# EAGLE design CAM_BOARD_V1_X (EAGLE 9.6.2)
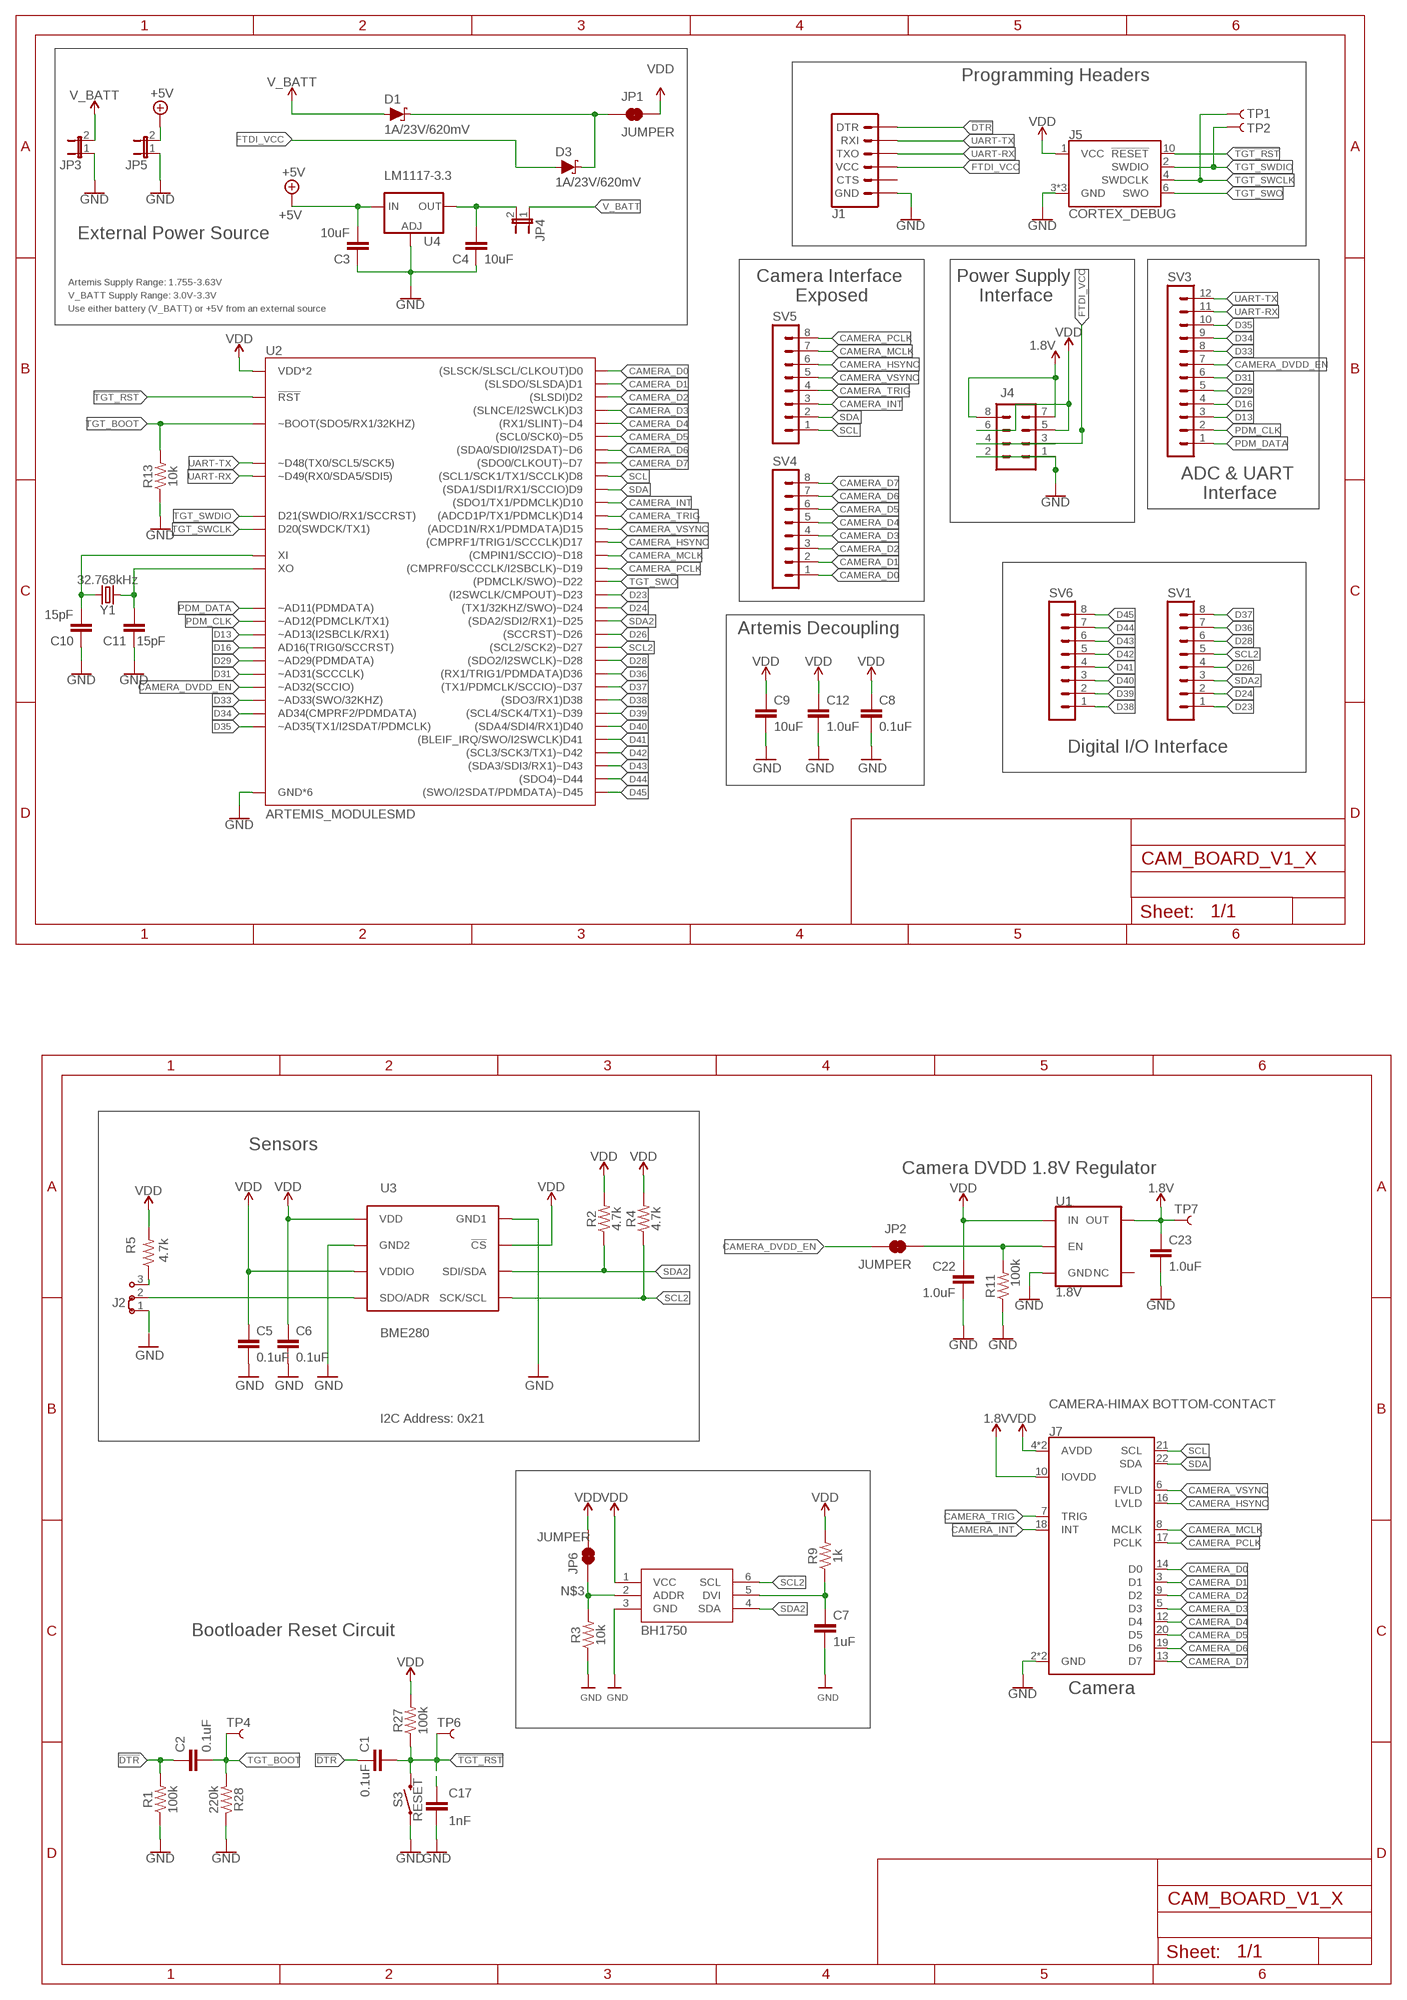
[diagram p0: schematic, sheet 1]

## Parts
C1  0.1uF  0.1UF-0603-25V-5%  [0603]
C2  0.1uF  0.1UF-0603-25V-(+80/-20%)  [0603]
C3  10uF  15PF-0603-50V-5%  [0603]
C4  10uF  15PF-0603-50V-5%  [0603]
C5  0.1uF  0.1UF-25V-5%(0603)  [0603-CAP]
C6  0.1uF  0.1UF-25V-5%(0603)  [0603-CAP]
C7  1uF  0.1UF-25V-5%(0603)  [0603-CAP]
C8  0.1uF  0.1UF-0402T-16V-10%  [0402-TIGHT]
C9  10uF  10UF-0603-6.3V-20%  [0603]
C10  15pF  15PF-0603-50V-5%  [0603]
C11  15pF  15PF-0603-50V-5%  [0603]
C12  1.0uF  1.0UF-0402T-16V-10%  [0402-TIGHT]
C17  1nF  1.0NF/1000PF-0603-50V-10%  [0603]
C22  1.0uF  1.0UF-0402-TIGHT-16V-10%  [0402-TIGHT]
C23  1.0uF  1.0UF-0402-TIGHT-16V-10%  [0402-TIGHT]
D1  1A/23V/620mV  DIODE-SCHOTTKY-BAT20J  [SOD-323]
D3  1A/23V/620mV  DIODE-SCHOTTKY-BAT20J  [SOD-323]
IC1  BH1750  [WSOF-6]
J1  6_PIN_SERIAL_TARGETSMD  [1X06-SMD_RA_MALE]
J2  J2X2MM  [04C]
J4  MA04-2  [MA04-2]
J5  CORTEX_DEBUG  CORTEX_DEBUG_MINIMUM_PTH  [2X5-PTH-1.27MM]
J7  CAMERA-HIMAX BOTTOM-CONTACT  CAMERA-HIMAXBOTTOM-CONTACT  [FPC-24-AMPHENOL-SFV24R-1STE1HLF]
JP1  JUMPER  JUMPER-COMBO_2_NC_TRACE  [COMBO-JUMPER_2_NC_TRACE]
JP2  JUMPER  JUMPER-COMBO_2_NC_TRACE  [COMBO-JUMPER_2_NC_TRACE]
JP3  JP1E  [JP1]
JP4  JP1E  [JP1]
JP5  JP1E  [JP1]
JP6  JUMPER  JUMPER-COMBO_2_NC_TRACE  [COMBO-JUMPER_2_NC_TRACE]
R1  100k  100KOHM-0603-1/10W-1%  [0603]
R2  4.7k  1KOHM-0603-1/10W-1%  [0603@1]
R3  10k  1KOHM-0603-1/10W-1%  [0603@1]
R4  4.7k  1KOHM-0603-1/10W-1%  [0603@1]
R5  4.7k  1KOHM-0603-1/10W-1%  [0603@1]
R9  1k  1KOHM-0603-1/10W-1%  [0603@1]
R11  100k  100KOHM-0402T-1/16W-1%  [0402-TIGHT]
R13  10k  10KOHM-0603-1/10W-1%  [0603@1]
R27  100k  100KOHM-0603-1/10W-1%  [0603]
R28  220k  220KOHM-0603-1/10W-1%  [0603]
S3  RESET  MOMENTARY-SWITCH-SPST-SMD-4.6X2.8MM  [TACTILE_SWITCH_SMD_4.6X2.8MM]
SV1  MA08-1  [MA08-1]
SV3  MA12-1  [MA12-1]
SV4  MA08-1  [MA08-1]
SV5  MA08-1  [MA08-1]
SV6  MA08-1  [MA08-1]
TP1  TEST-POINT3X5  [PAD.03X.05]
TP2  TEST-POINT3X5  [PAD.03X.05]
TP4  TEST-POINT3X5  [PAD.03X.05]
TP6  TEST-POINT3X5  [PAD.03X.05]
TP7  TEST-POINT3X5  [PAD.03X.05]
U1  1.8V  V_REG_AP2127K-1.8V  [SOT23-5]
U2  ARTEMIS_MODULESMD  [ARTEMIS_FP]
U3  BME280  [BME280_LGA]
U4  LM1117-3.3  V_REG_LM1117SOT223  [SOT223]
Y1  32.768kHz  CRYSTAL-32.768KHZSMD-3.2X1.5  [CRYSTAL-SMD-3.2X1.5MM]

## Nets
1.8V: C23.1 J4.7 J4.8 J7.10(IOVDD) TP7.P$1 U1.5(OUT)
!DTR: C1.1 C2.1 J1.1(DTR) R1.2
!TGT_RST: C1.2 C17.1 J5.10(!RESET) R27.1 S3.3 S3.4 TP6.P$1 U2.~RST(!RST)
+5V: C3.2 JP5.2 U4.3(IN)
CAMERA_D0: J7.14(D0) SV4.1 U2.D0((SLSCK/SLSCL/CLKOUT)D0)
CAMERA_D1: J7.3(D1) SV4.2 U2.D1((SLSDO/SLSDA)D1)
CAMERA_D2: J7.9(D2) SV4.3 U2.D2((SLSDI)D2)
CAMERA_D3: J7.5(D3) SV4.4 U2.D3((SLNCE/I2SWCLK)D3)
CAMERA_D4: J7.12(D4) SV4.5 U2.~D4((RX1/SLINT)~D4)
CAMERA_D5: J7.20(D5) SV4.6 U2.~D5((SCL0/SCK0)~D5)
CAMERA_D6: J7.19(D6) SV4.7 U2.~D6((SDA0/SDI0/I2SDAT)~D6)
CAMERA_D7: J7.13(D7) SV4.8 U2.D7((SDO0/CLKOUT)~D7)
CAMERA_DVDD_EN: JP2.1 JP2.3 SV3.7 U2.~AD32(~AD32(SCCIO))
CAMERA_HSYNC: J7.16(LVLD) SV5.6 U2.D17((CMPRF1/TRIG1/SCCCLK)D17)
CAMERA_INT: J7.18(INT) SV5.3 U2.D10((SDO1/TX1/PDMCLK)D10)
CAMERA_MCLK: J7.8(MCLK) SV5.7 U2.~D18((CMPIN1/SCCIO)~D18)
CAMERA_PCLK: J7.17(PCLK) SV5.8 U2.~D19((CMPRF0/SCCCLK/I2SBCLK)~D19)
CAMERA_TRIG: J7.7(TRIG) SV5.4 U2.D14((ADCD1P/TX1/PDMCLK)D14)
CAMERA_VSYNC: J7.6(FVLD) SV5.5 U2.D15((ADCD1N/RX1/PDMDATA)D15)
D13: SV3.3 U2.~AD13(~AD13(I2SBCLK/RX1))
D16: SV3.4 U2.AD16(AD16(TRIG0/SCCRST))
D23: SV1.1 U2.~D23((I2SWCLK/CMPOUT)~D23)
D24: SV1.2 U2.~D24((TX1/32KHZ/SWO)~D24)
D26: SV1.4 U2.~D26((SCCRST)~D26)
D28: SV1.6 U2.~D28((SDO2/I2SWCLK)~D28)
D29: SV3.5 U2.~AD29(~AD29(PDMDATA))
D31: SV3.6 U2.~AD31(~AD31(SCCCLK))
D33: SV3.8 U2.~AD33/SWO(~AD33(SWO/32KHZ))
D34: SV3.9 U2.AD34(AD34(CMPRF2/PDMDATA))
D35: SV3.10 U2.~AD35(~AD35(TX1/I2SDAT/PDMCLK))
D36: SV1.7 U2.D36((RX1/TRIG1/PDMDATA)D36)
D37: SV1.8 U2.~D37((TX1/PDMCLK/SCCIO)~D37)
D38: SV6.1 U2.D38((SDO3/RX1)D38)
D39: SV6.2 U2.~D39((SCL4/SCK4/TX1)~D39)
D40: SV6.3 U2.D40((SDA4/SDI4/RX1)D40)
D41: SV6.4 U2.D41((BLEIF_IRQ/SWO/I2SWCLK)D41)
D42: SV6.5 U2.~D42((SCL3/SCK3/TX1)~D42)
D43: SV6.6 U2.~D43((SDA3/SDI3/RX1)~D43)
D44: SV6.7 U2.~D44((SDO4)~D44)
D45: SV6.8 U2.~D45((SWO/I2SDAT/PDMDATA)~D45)
FTDI_VCC: D3.A J1.4(VCC) J4.3 J4.4
GND: C3.1 C4.1 C5.2 C6.2 C7.2 C8.1 C9.2 C10.1 C11.1 C12.2 C17.2 C22.2 C23.2 IC1.3(GND) J1.6(GND) J4.1 J4.2 J5.3(GND) J5.5(GND) J5.9(GND) J7.2(GND) J7.15(GND) JP3.1 JP5.1 R1.1 R3.1 R11.1 R13.1 R28.1 S3.1 S3.2 U1.2(GND) U2.GND@1(GND*6) U2.GND@22(GND*6) U2.GND@38(GND*6) U2.GND@39(GND*6) U2.GND@47(GND*6) U2.GND@59(GND*6) U3.P$1(GND1) U3.P$7(GND2) U4.1(ADJ)
N$1: JP2.2 JP2.4 R11.2 U1.3(EN)
N$2: C7.1 IC1.5(DVI) R9.1
N$3: IC1.2(ADDR) JP6.1 JP6.3 R3.2
N$4: C4.2 JP4.2 U4.2(OUT) U4.4(OUT)
N$5: J2.3 R5.1
N$7: J2.2 U3.P$5(SDO/ADR)
N$14: C10.2 U2.XI Y1.P$2
N$15: C11.2 U2.XO Y1.P$1
PDM_CLK: SV3.2 U2.~AD12(~AD12(PDMCLK/TX1))
PDM_DATA: SV3.1 U2.~AD11(~AD11(PDMDATA))
SCL: J7.21(SCL) SV5.1 U2.D8((SCL1/SCK1/TX1/SCCLK)D8)
SCL1: J2.1
SCL2: IC1.6(SCL) R4.1 SV1.5 U2.~D27((SCL2/SCK2)~D27) U3.P$4(SCK/SCL)
SDA: J7.22(SDA) SV5.2 U2.D9((SDA1/SDI1/RX1/SCCIO)D9)
SDA2: IC1.4(SDA) R2.1 SV1.3 U2.~D25((SDA2/SDI2/RX1)~D25) U3.P$3(SDI/SDA)
TGT_BOOT: C2.2 R13.2 R28.2 TP4.P$1 U2.BOOT(~BOOT(SDO5/RX1/32KHZ))
TGT_SWCLK: J5.4(SWDCLK) TP1.P$1 U2.SWDCK(D20(SWDCK/TX1))
TGT_SWDIO: J5.2(SWDIO) TP2.P$1 U2.SWDIO(D21(SWDIO/RX1/SCCRST))
TGT_SWO: J5.6(SWO) U2.~D22((PDMCLK/SWO)~D22)
UART-RX: J1.3(TXO) SV3.11 U2.RXI-0(~D49(RX0/SDA5/SDI5))
UART-TX: J1.2(RXI) SV3.12 U2.TXO-0(~D48(TX0/SCL5/SCK5))
V_BATT: D1.A JP3.2 JP4.1
VDD: C5.1 C6.1 C8.2 C9.1 C12.1 C22.1 IC1.1(VCC) J4.5 J4.6 J5.1(VCC) J7.4(AVDD) J7.11(AVDD) JP1.2 JP1.4 JP6.2 JP6.4 R2.2 R4.2 R5.2 R9.2 R27.2 U1.1(IN) U2.VDD@36(VDD*2) U2.VDD@37(VDD*2) U3.P$2(!CS) U3.P$6(VDDIO) U3.P$8(VDD)
VIN1: D1.C D3.C JP1.1 JP1.3
Unconnected: J1.5(CTS) J7.MNT1@0(MNT1) J7.MNT1@1(MNT1) J7.MNT2@0(MNT2) J7.MNT2@1(MNT2) U1.4(NC)

## Notes on the sheet
- Programming Headers
- External Power Source
- Artemis Supply Range: 1.755-3.63V
- Camera Interface 
  Exposed
- Power Supply 
  Interface
- V_BATT Supply Range: 3.0V-3.3V
- Use either battery (V_BATT) or +5V from an external source
- ADC & UART 
  Interface
- Artemis Decoupling
- Digital I/O Interface
- Sensors
- Camera DVDD 1.8V Regulator
- I2C Address: 0x21
- Bootloader Reset Circuit
- Camera

## Library data of the parts
C1 = SparkFun-Capacitors:0.1UF: 0.1µF ceramic capacitors A capacitor is a passive two-terminal electrical component used to store electrical energy temporarily in an electric field.; PROD_ID: CAP-08604
C2 = SparkFun-Capacitors:0.1UF: 0.1µF ceramic capacitors A capacitor is a passive two-terminal electrical component used to store electrical energy temporarily in an electric field.; PROD_ID: CAP-00810
C3 C4 = SparkFun-Capacitors:15PF: 15pF ceramic capacitors A capacitor is a passive two-terminal electrical component used to store electrical energy temporarily in an electric field.; PROD_ID: CAP-07881; VALUE: 15pF
C5 C6 = SparkFun-Capacitors:0.1UF-25V-5%(0603): CAP-08604; PROD_ID: CAP-08604
C7 = SparkFun-Capacitors:0.1UF-25V-5%(0603): CAP-08604; PROD_ID: CAP-08604; VALUE: 0.1uF
C8 = SparkFun-Capacitors:0.1UF: 0.1µF ceramic capacitors A capacitor is a passive two-terminal electrical component used to store electrical energy temporarily in an electric field.; PROD_ID: CAP-12416
C9 = SparkFun-Capacitors:10UF: 10.0µF ceramic capacitors A capacitor is a passive two-terminal electrical component used to store electrical energy temporarily in an electric field.; PROD_ID: CAP-11015
C10 C11 = SparkFun-Capacitors:15PF: 15pF ceramic capacitors A capacitor is a passive two-terminal electrical component used to store electrical energy temporarily in an electric field.; PROD_ID: CAP-07881
C12 = SparkFun-Capacitors:1.0UF: 1µF ceramic capacitors A capacitor is a passive two-terminal electrical component used to store electrical energy temporarily in an electric field.; PROD_ID: CAP-12417
C17 = SparkFun-Capacitors:1.0NF/1000PF: 1nF/1,000pF ceramic capacitors A capacitor is a passive two-terminal electrical component used to store electrical energy temporarily in an electric field.; PROD_ID: CAP-07886
C22 C23 = ambiq:1.0UF: 1µF ceramic capacitors A capacitor is a passive two-terminal electrical component used to store electrical energy temporarily in an electric field.; PROD_ID: CAP-12417
D1 D3 = SparkFun-DiscreteSemi:DIODE-SCHOTTKY: Schottky diode A Schottky diode is a semiconductor diode which has a low forward voltage drop and a very fast switching action.; PROD_ID: DIO-11623
IC1 = microbuilder:BH1750
J1 = SparkFun-Connectors:6_PIN_SERIAL_TARGET: 6-pin header connection for use with the "FTDI BASIC" pinout - TARGET SIDE. Also known as "Arduino Serial Program Header". It is used to mate with our FTDI Basic serial programmers using the Arduino IDE. Note, this device has "TARGET" in the name. It is intended to be used on a design that contains a target micro-controller that you wish to program. The "sister" device, named "CABLE" is inteneded to be used on a design that usually lives on the end of your USB cable and prvides the converter chip (FTDI232 or FTDI231x) to commnicate serial RX/TX. You can populate with some of these: Break Away Headers - Straight <https://www.sparkfun.com/products/116> (PRT-00116) For reference (or to suit your programming needs) check out these designs: SparkFun FTDI Basic Breakout - 5V <https://www.sparkfun.com/products/9716> (DEV-09716) SparkFun FTDI Basic Breakout - 3.3V <https://www.sparkfun.com/products/9873> (DEV-09873) SparkFun FTDI SmartBasic <https://www.sparkfun.com/products/12935> (DEV-12935) SparkFun Beefy 3 - FTDI Basic Breakout <https://www.sparkfun.com/products/13746> (DEV-13746); PROD_ID: CONN-08971
J2 = jumper:J2: Jumper switch 2 x 2.5 mm
J4 = con-lstb:MA04-2: PIN HEADER; OC_FARNELL: unknown; OC_NEWARK: unknown
J5 = SparkFun-Connectors:CORTEX_DEBUG_MINIMUM: Cortex Debug Connector - 10 pin Supports JTAG debug, Serial Wire debug, and Serial Wire Viewer. PTH and SMD connector options available. General Connector Information <http://infocenter.arm.com/help/topic/com.arm.doc.faqs/attached/13634/cortex_debug_connectors.pdf> Products: PTH Connector <http://www.digikey.com/product-detail/en/cnc-tech/3220-10-0100-00/1175-1627-ND/3883661> -via Digi-Key SparkFun PSoc <https://www.sparkfun.com/products/13229> SparkFun T <https://www.sparkfun.com/products/13810>
J7 = SparkFun-Connectors:CAMERA-HIMAX; DIGIKEY: 609-4320-2-ND; PROD_ID: CONN-14233
JP1 JP2 JP6 = SparkFun-Jumpers:JUMPER-COMBO_2_NC_TRACE
JP3-JP5 = jumper:JP1E: JUMPER
R1 R27 = SparkFun-Resistors:100KOHM: 100kΩ resistor A resistor is a passive two-terminal electrical component that implements electrical resistance as a circuit element. Resistors act to reduce current flow, and, at the same time, act to lower voltage levels within circuits. - Wikipedia; PROD_ID: RES-07828
R2-R5 = SparkFun-Resistors:1KOHM: 1kΩ resistor A resistor is a passive two-terminal electrical component that implements electrical resistance as a circuit element. Resistors act to reduce current flow, and, at the same time, act to lower voltage levels within circuits. - Wikipedia; PROD_ID: RES-07856; VALUE: 1k
R9 = SparkFun-Resistors:1KOHM: 1kΩ resistor A resistor is a passive two-terminal electrical component that implements electrical resistance as a circuit element. Resistors act to reduce current flow, and, at the same time, act to lower voltage levels within circuits. - Wikipedia; PROD_ID: RES-07856
R11 = SparkFun-Resistors:100KOHM: 100kΩ resistor A resistor is a passive two-terminal electrical component that implements electrical resistance as a circuit element. Resistors act to reduce current flow, and, at the same time, act to lower voltage levels within circuits. - Wikipedia; PROD_ID: RES-13495
R13 = SparkFun-Resistors:10KOHM: 10kΩ resistor A resistor is a passive two-terminal electrical component that implements electrical resistance as a circuit element. Resistors act to reduce current flow, and, at the same time, act to lower voltage levels within circuits. - Wikipedia; PROD_ID: RES-00824
R28 = SparkFun-Resistors:220KOHM: 220kΩ resistor A resistor is a passive two-terminal electrical component that implements electrical resistance as a circuit element. Resistors act to reduce current flow, and, at the same time, act to lower voltage levels within circuits. - Wikipedia; PROD_ID: RES-08969
S3 = SparkFun-Switches:MOMENTARY-SWITCH-SPST: Momentary Switch (Pushbutton) - SPST Normally-open (NO) SPST momentary switches (buttons, pushbuttons). Variants PTH-12MM - 12mm square, through-hole Momentary Pushbutton Switch - 12mm Square <https://www.sparkfun.com/products/9190> (COM-09190) PTH-6.0MM, PTH-6.0MM-KIT - 6.0mm square, through-hole Mini Pushbutton Switch <https://www.sparkfun.com/products/97> (COM-00097) KIT package intended for soldering kit's - only one side of pads' copper is exposed. PTH-RIGHT-ANGLE-KIT - Right-angle, through-hole Right Angle Tactile Button <https://www.sparkfun.com/products/10791> - Used on SparkFun BigTime Watch Kit <https://www.sparkfun.com/products/11734> SMD-12MM - 12mm square, surface-mount Tactile Button - SMD (12mm) <https://www.sparkfun.com/products/12993> (COM-12993) Used on SparkFun PicoBoard <https://www.sparkfun.com/products/11888> SMD-4.5MM - 4.5mm Square Trackball Switch Used on SparkFun Blackberry Trackballer Breakout <https://www.sparkfun.com/products/13169> SMD-4.6MMX2.8MM - 4.60mm x 2.80mm, surface mount Used on SparkFun SAMD21 Mini Breakout <https://www.sparkfun.com/products/13664> SMD-5.2MM, SMD-5.2-REDUNDANT - 5.2mm square, surface-mount Mini Pushbutton Switch - SMD <https://www.sparkfun.com/products/8720> (COM-08720) Used on Arduino Pro Mini <https://www.sparkfun.com/products/11114> REDUNDANT package connects both switch circuits together SMD-6.0X3.5MM - 6.0 x 3.5mm, surface mount Momentary Reset Switch SMD <https://www.sparkfun.com/products/8229> (COM-08229) SMD-6.2MM-TALL - 6.2mm square, surface mount Tactile Button - SMD (6mm) <https://www.sparkfun.com/products/12992> Used on SparkFun Digital Sandbox <https://www.sparkfun.com/products/12651> SMD-RIGHT-ANGLE - Right-angle, surface mount Used on SparkFun Block for Intel® Edison - Arduino <https://www.sparkfun.com/products/13036>; PROD_ID: SWCH-13065
SV1 SV4-SV6 = con-lstb:MA08-1: PIN HEADER; OC_FARNELL: unknown; OC_NEWARK: unknown
SV3 = con-lstb:MA12-1: PIN HEADER; OC_FARNELL: unknown; OC_NEWARK: unknown
TP1 TP2 TP4 TP6 TP7 = SparkFun-Connectors:TEST-POINT: SparkFun Test Points Bare copper test points for troubleshooting or In-Circuit-Testing. These are used by our Production team for verifying production board runs using pogo-pins on test beds. SparkFun Products: SparkFun LSM9DS1 Breakout <https://www.sparkfun.com/products/13284> SparkFun PSOC <https://www.sparkfun.com/products/13714> SparkFun Load Cell Amplifier <https://www.sparkfun.com/products/13879>
U1 = SparkFun-IC-Power:V_REG_AP2127: AP2127 - 300mA CMOS LDO Regulator w/ Enable The AP2127 is CMOS process low dropout linear regulator with enable function, the regulator delivers a guaranteed 300mA (min.) continuous load current. Features Output Voltage Accuracy: ±1.5% Output Current: 300mA (Min.) Foldback Short Current Protection: 50mA Enable Function to Turn ON/OFF VOUT Low Dropout Voltage (3.3V): 250mV (Typ.) @IOUT=600mA Excellent Load Regulation: 0.2%/A (Typ.) Excellent Line Regulation: 0.02%/V (Typ.) Low Quiescent Current: 55μA (Typ.) Low Standby Current: 0.01μA (Typ.) Low Output Noise: 50μVRMS PSRR: 100Hz -65dB, 1kHz -65dB OTSD Protection Stable with 1.0μF Flexible Cap: Ceramic, Tantalum and Aluminum Electrolytic Operation Temperature Range: -40°C to 85°C ESD: MM 400V, HBM 4000V; PROD_ID: VREG-14239
U2 = SparkFun-IC-Microcontroller:ARTEMIS_MODULE: Description: The Artemis Module from SparkFun is a Cortex-M4F with BLE 5.0 running up to 96MHz and with as low power as 6uA per MHz (less than 5mW). This is the world's first module to bridge the market between hobbyists and consumer products. We've packaged all the power of a modern microcontroller into a module that is both extremely easy to use but is mass-market ready. The flexibility of the Artemis module starts with our [Arduino core](https://github.com/sparkfun/Arduino_Apollo3). You can program and use the Artemis module just like you would an Uno or any other Arduino. Time to first blink is just 5 minutes away! We built the core from the ground up, making it fast and as light weight as possible.; PROD_ID: SUB-14479
U3 = BME280ComponentLibrary:BME280; PROD_ID: IC-13090
U4 = SparkFun-IC-Power:V_REG_LM1117: Voltage Regulator LM1117 Standard adjustable voltage regulator but in SMD form. Spark Fun Electronics SKU : COM-00595; PROD_ID: VREG-08170
Y1 = SparkFun-Clocks:CRYSTAL-32.768KHZ: 32.768kHz Crystal Frequency: 32.768kHz Frequency Stability: ±20ppm Load Capacitance: 12.5pF (PTH-2X6 & SMD-3.2X1.5), 6pF (SMD-2X6) SparkFun Products: SparkFun BigTime Watch Kit <https://www.sparkfun.com/products/11734> SparkFun nRF52832 Breakout <https://www.sparkfun.com/products/13990> SparkFun Real Time Clock Module <https://www.sparkfun.com/products/12708>; PROD_ID: XTAL-13062

## Board
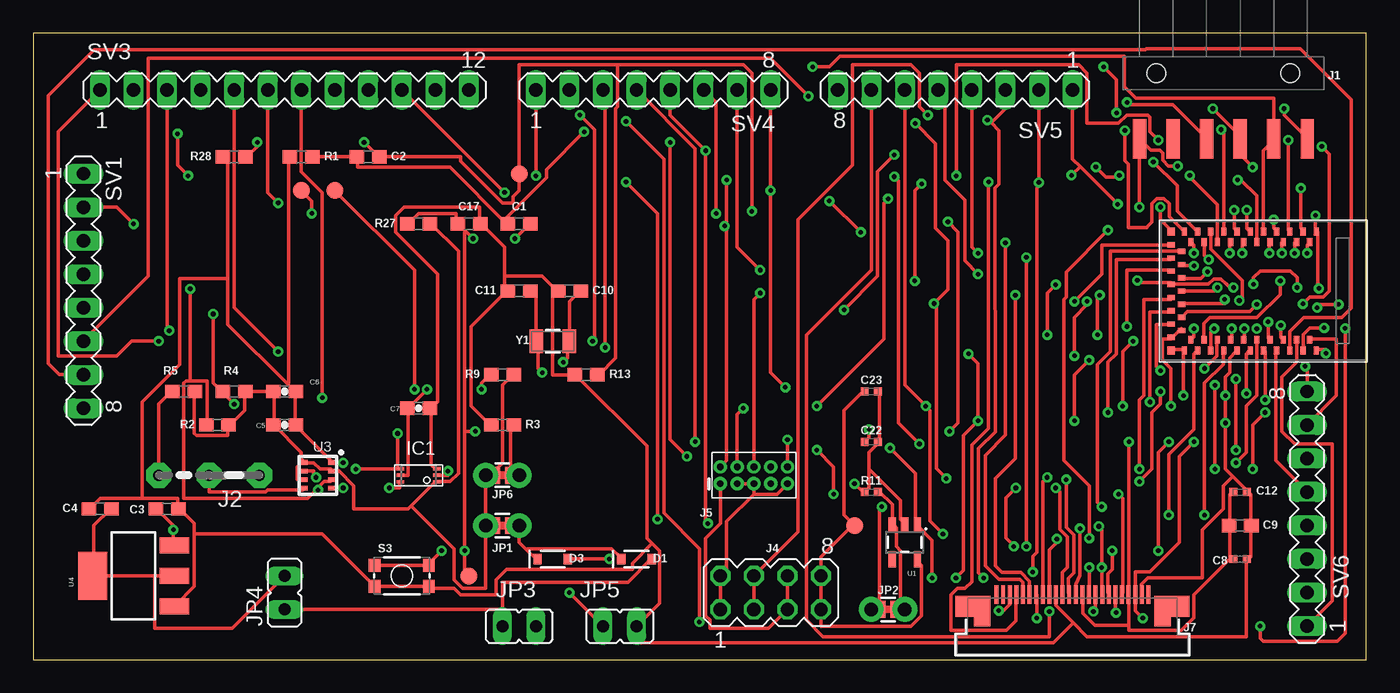
[diagram p1: board, top side]
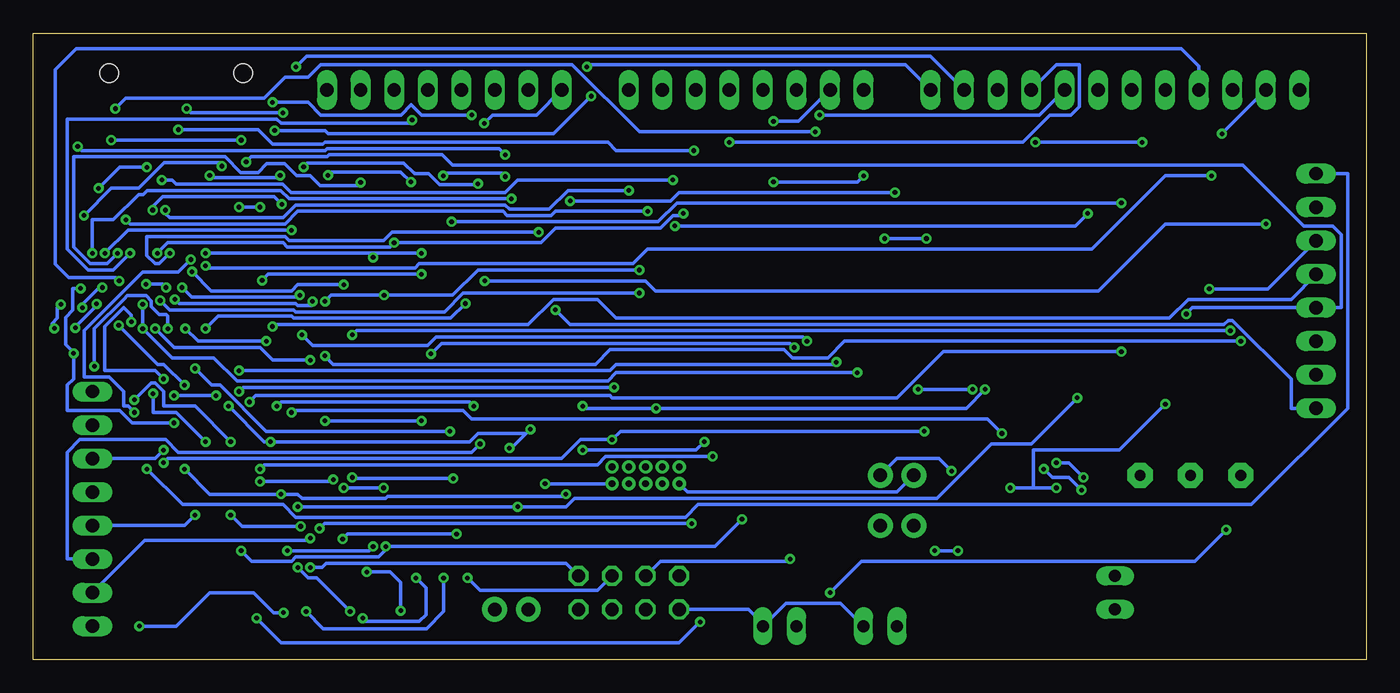
[diagram p2: board, bottom side, seen from below]

Size 101.02 x 47.49 mm. Coordinates in mm from the lower left corner, seen from the top.
Outline: 0,0 101.02,0 101.02,47.49 0,47.49 0,0
Copper layers (1*16): Top 0.035mm / dielectric 1.5mm / Bottom 0.035mm
Design rules "default *": minimum track width 10mil, minimum drill 0.35mm, track to track 6mil, track to pad 6mil, pad to pad 6mil, via to via 6mil, smd to smd 6mil, copper to edge 40mil, drill to drill 10mil, minimum pad ring 10mil, minimum via ring 8mil, stop-mask expansion 4mil, vias tented up to drill 0mil, thermal gap 10mil

### Footprints (pad centres in the part's own frame; a part is rotated, then mirrored left to right if it is on the bottom)
0603 = smd 1.1 x 1: 1 -0.85,0; 2 0.85,0
0603-CAP = smd 1.1 x 1: 1 -0.85,0; 2 0.85,0
0402-TIGHT = smd 0.6 x 0.6: 1 -0.5,0; 2 0.5,0
SOD-323 = smd 0.63 x 0.83: A 1.15,0; C -1.15,0
WSOF-6 = smd 0.55 x 0.25: 1 -1.375,0.5; 2 -1.375,0; 3 -1.375,-0.5; 4 1.375,-0.5; 5 1.375,0; 6 1.375,0.5
1X06-SMD_RA_MALE = smd 1 x 3: 1 -6.35,5; 2 -3.81,5; 3 -1.27,5; 4 1.27,5; 5 3.81,5; 6 6.35,5 | hole 1.4: -5.08,0; 5.08,0
04C = drill 0.813 pad 1.905 octagon: 1 -1.905,0; 2 1.905,0; 3 5.715,0
MA04-2 = drill 1.016 octagon: 1 -3.81,-1.27; 2 -3.81,1.27; 3 -1.27,-1.27; 4 -1.27,1.27; 5 1.27,-1.27; 6 1.27,1.27; 7 3.81,-1.27; 8 3.81,1.27
2X5-PTH-1.27MM = drill 0.508 pad 1: 1 -2.54,-0.635; 2 -2.54,0.635; 3 -1.27,-0.635; 4 -1.27,0.635; 5 0,-0.635; 6 0,0.635; 7 1.27,-0.635; 8 1.27,0.635; 9 2.54,-0.635; 10 2.54,0.635
FPC-24-AMPHENOL-SFV24R-1STE1HLF = smd 0.3 x 1.4: 1 5.75,2.4; 2 5.25,2.4; 3 4.75,2.4; 4 4.25,2.4; 5 3.75,2.4; 6 3.25,2.4; 7 2.75,2.4; 8 2.25,2.4; 9 1.75,2.4; 10 1.25,2.4; 11 0.75,2.4; 12 0.25,2.4; 13 -0.25,2.4; 14 -0.75,2.4; 15 -1.25,2.4; 16 -1.75,2.4; 17 -2.25,2.4; 18 -2.75,2.4; 19 -3.25,2.4; 20 -3.75,2.4; 21 -4.25,2.4; 22 -4.75,2.4; 23 -5.25,2.4; 24 -5.75,2.4 | smd 1.4 x 1.6: MNT1@0 -8.15,1.5; MNT2@1 8.15,1.5 | smd 1.25 x 2.3: MNT1@1 -6.825,1.15; MNT2@0 6.825,1.15
COMBO-JUMPER_2_NC_TRACE = smd 0.635 x 1.27: 1 -0.508,0; 2 0.508,0 | drill 1.016 pad 1.88: 3 -1.27,0; 4 1.27,0
JP1 = drill 0.914 long: 1 0,-1.27; 2 0,1.27
0603@1 = smd 1.1 x 1: 1 -0.85,0; 2 0.85,0
TACTILE_SWITCH_SMD_4.6X2.8MM = smd 0.9 x 1: 1 -2.05,-0.8; 2 2.05,-0.8; 3 2.05,0.8; 4 -2.05,0.8
MA08-1 = drill 1.016 long: 1 -8.89,0; 2 -6.35,0; 3 -3.81,0; 4 -1.27,0; 5 1.27,0; 6 3.81,0; 7 6.35,0; 8 8.89,0
MA12-1 = drill 1.016 long: 1 -13.97,0; 2 -11.43,0; 3 -8.89,0; 4 -6.35,0; 5 -3.81,0; 6 -1.27,0; 7 1.27,0; 8 3.81,0; 9 6.35,0; 10 8.89,0; 11 11.43,0; 12 13.97,0
PAD.03X.05 = smd 1.27 x 1.27: P$1 0,0
SOT23-5 = smd 0.55 x 1.2: 1 -0.95,-1.3; 2 0,-1.3; 3 0.95,-1.3; 4 0.95,1.3; 5 -0.95,1.3
ARTEMIS_FP = smd 0.4 x 0.6: AD16 -4,-3.7; BOOT 1.5,4.5; D0 0.5,-4.5; D1 -0.5,-4.5; D2 -1,-3.7; D3 2,-3.7; D7 -1.5,4.5; D8 -0.5,4.5; D9 2,3.7; D10 1,3.7; D14 -5,3.7; D17 -3.5,-4.5; D36 2.5,-4.5; D38 3,-3.7; D40 2.5,4.5; D41 -2.5,-4.5; GND@1 4.5,4.5; GND@39 -5.5,-4.5; GND@47 -1.5,-4.5; GND@59 4.5,-4.5; RXI-0 3.5,4.5; SWDCK 4,3.7; SWDIO 0,3.7; TXO-0 0.5,4.5; ~AD31 -3,-3.7; ~AD35 -2,3.7; ~D4 -2.5,4.5; ~D5 -1,3.7; ~D18 -4.5,-4.5; ~D19 -5,-3.7; ~D22 -3.5,4.5; ~D23 -4,3.7; ~D24 -3,3.7; ~D27 -4.5,4.5; ~D28 -5.5,4.5; ~D37 3.5,-4.5; ~D39 3,3.7; ~D42 1.5,-4.5; ~D43 1,-3.7; ~D44 4,-3.7; ~D45 -2,-3.7; ~RST 0,-3.7 | smd 0.6 x 0.4: AD34 -6.5,-0.5; D15 -6.5,0.5; VDD@36 -5.7,-3; VDD@37 -6.5,-3.5; XI -6.5,-2.5; XO -5.7,-2; ~AD11 -5.7,-1; ~AD12 -5.7,2; ~AD13 -5.7,1; ~AD29 -6.5,-1.5; ~AD32 -5.7,3; ~AD33/SWO -5.7,0; ~D6 -6.5,3.5; ~D25 -6.5,2.5; ~D26 -6.5,1.5 | smd 0.6 x 0.6: GND@22 -6.5,4.5; GND@38 -6.5,-4.5
BME280_LGA = smd 0.5 x 0.35: P$1 1.025,0.975; P$2 1.025,0.325; P$3 1.025,-0.325; P$4 1.025,-0.975; P$5 -1.025,-0.975; P$6 -1.025,-0.325; P$7 -1.025,0.325; P$8 -1.025,0.975
SOT223 = smd 1.219 x 2.235: 1 -2.311,-3.099; 2 0,-3.099; 3 2.311,-3.099 | smd 3.6 x 2.2: 4 0,3.099
CRYSTAL-SMD-3.2X1.5MM = smd 1 x 1.8: P$1 -1.25,0; P$2 1.25,0

### Placement (x,y rotation side)
C1  36.83,33.02 0 top
C2  25.4,38.1 0 top
C3  10.16,11.43 180 top
C4  5.08,11.43 0 top
C5  19.05,17.78 0 top
C6  19.05,20.32 0 top
C7  29.21,19.05 0 top
C8  91.44,7.62 180 top
C9  91.44,10.16 0 top
C10  40.64,27.94 0 top
C11  36.83,27.94 0 top
C12  91.44,12.7 0 top
C17  33.02,33.02 0 top
C22  63.5,16.51 0 top
C23  63.5,20.32 0 top
D1  45.72,7.62 0 top
D3  39.37,7.62 0 top
IC1  29.21,13.97 180 top
J1  90.17,44.45 180 top
J2  15.24,13.97 180 top
J4  55.88,5.08 0 top
J5  54.61,13.97 0 top
J7  78.74,2.54 0 top
JP1  35.56,10.16 180 top
JP2  64.77,3.81 0 top
JP3  36.83,2.54 90 top
JP4  19.05,5.08 0 top
JP5  44.45,2.54 90 top
JP6  35.56,13.97 180 top
R1  20.32,38.1 0 top
R2  13.97,17.78 0 top
R3  35.56,17.78 0 top
R4  15.24,20.32 0 top
R5  11.43,20.32 0 top
R9  35.56,21.59 0 top
R11  63.5,12.7 0 top
R13  41.91,21.59 0 top
R27  29.21,33.02 0 top
R28  15.24,38.1 0 top
S3  27.94,6.35 0 top
SV1  3.81,27.94 270 top
SV3  19.05,43.18 0 top
SV4  46.99,43.18 0 top
SV5  69.85,43.18 180 top
SV6  96.52,11.43 90 top
TP1  22.86,35.56 0 top
TP2  20.32,35.56 0 top
TP4  36.83,36.83 0 top
TP6  33.02,6.35 0 top
TP7  62.23,10.16 0 top
U1  66.04,8.89 180 top
U2  92.71,27.94 0 top
U3  21.59,13.97 0 top
U4  7.62,6.35 90 top
Y1  39.37,24.13 0 top

### Tracks (layer width: path | path; a pad name or v marks a point on that pad's centre or on a via)
1.8V  (via drill 0.35)
  Top 0.254: U1.5 66.99,7.46 67.31,7.14 67.31,3.33 66.52,2.54 59.69,2.54 J4.7 J4.8 59.69,7.78 62.07,10.16 TP7.P$1 61.44,10.95 61.44,18.89 62.87,20.32 C23.1 | v80.01,6.99 80.01,5.08 J7.10
  Bottom 0.254: v80.01,6.99 79.11,6.99 78.8,7.3 60.64,7.3 J4.8
!DTR  (via drill 0.35)
  Top 0.254: R1.2 C2.1 24.61,38.1 24.61,37.31 31.59,37.31 35.88,33.02 C1.1 35.72,33.34 38.89,36.51 38.89,37.15 v41.75,40.01 | v94.77,41.75 94.77,41.27 96.52,39.53 J1.1
  Bottom 0.254: v94.77,41.75 93.98,42.55 83.5,42.55 81.92,44.13 80.17,44.13 79.22,45.09 60.17,45.09 55.09,40.01 v41.75,40.01
!TGT_RST  (via drill 0.35)
  Top 0.254: S3.4 26.04,7.14 29.84,7.14 S3.3 30,7.3 v30.96,8.26 | R27.1 28.42,33.02 29.21,33.81 32.07,33.81 32.07,33.02 C17.1 32.23,33.02 32.78,32.46 | v36.51,31.91 37.62,33.02 C1.2 | 32.78,32.46 v33.34,31.91 | TP6.P$1 32.7,6.67 v32.7,8.26 32.7,17.3 | 32.7,17.3 32.7,32.38 32.78,32.46 | U2.~RST 92.71,20 91.92,19.21 91.92,15.72 v91.12,14.92 | J5.10 v57.15,16.67 | v33.5,17.3 32.7,17.3
  Bottom 0.254: v33.34,31.91 v36.51,31.91 | v32.7,8.26 v30.96,8.26 | v91.12,14.92 90.81,15.24 60.96,15.24 59.53,16.67 v57.15,16.67 56.52,17.3 v33.5,17.3
+5V  (via drill 0.35)
  Top 0.254: C3.2 9.37,11.43 10.64,10.16 v10.64,9.84 10.64,8.73 U4.3 | v40.64,5.08 JP5.2
  Bottom 0.254: v40.64,5.08 38.26,7.46 13.02,7.46 v10.64,9.84
CAMERA_D0  (via drill 0.35)
  Top 0.254: v93.34,19.68 93.34,23.34 U2.D0 | v86.04,16.51 85.25,15.72 v85.25,8.26 | v74.3,8.57 74.3,8.64 73.69,9.24 73.69,12.26 v74.45,13.02 | v77.47,13.02 77.79,12.7 77.79,9.87 78.36,9.3 78.36,6.99 77.99,6.62 77.99,5.07 77.98,5.05 77.99,5.04 J7.14 | v38.1,36.67 SV4.1 | v44.93,36.2 47.31,33.81 v47.31,10.64
  Bottom 0.254: v93.34,19.68 92.08,20.95 91.76,20.95 91.12,20.32 91.12,19.21 88.74,19.21 v86.04,16.51 | v85.25,8.26 84.45,7.46 81.44,7.46 81.12,7.78 74.83,7.78 74.3,8.32 v74.3,8.57 49.37,8.57 v47.31,10.64 | v77.47,13.02 v74.45,13.02 | v38.1,36.67 38.58,36.2 v44.93,36.2
CAMERA_D1  (via drill 0.35)
  Top 0.254: v91.92,20.16 91.92,23.18 92.08,23.34 U2.D1 | v87.95,16.51 86.84,15.4 86.84,8.89 84.61,6.67 83.5,6.67 83.5,5.08 J7.3 83.5,4.92 83.5,3.71 v84.07,3.14 | v44.93,40.8 47.78,37.94 47.78,11.11 50.48,8.41 v50.48,2.86
  Bottom 0.254: v91.92,20.16 91.92,18.73 90.17,18.73 v87.95,16.51 | SV4.2 43.02,40.8 v44.93,40.8 | v50.48,2.86 52.07,1.27 82.2,1.27 v84.07,3.14
CAMERA_D2  (via drill 0.35)
  Top 0.254: v91.76,25.08 91.76,24.29 U2.D2 | v80.01,22.7 78.9,21.59 v78.9,18.1 | v69.91,6.19 70.48,6.76 70.48,16.99 v71.6,18.1 71.6,22.45 v70.87,23.18 | v80.33,3.65 80.49,3.81 80.49,4.92 J7.9 | SV4.3 43.34,43.02 v43.34,23.65
  Bottom 0.254: v91.76,25.08 90.33,23.65 83.82,23.65 82.87,22.7 v80.01,22.7 | v71.6,18.1 v78.9,18.1 | v69.91,6.19 69.91,3.65 71.22,2.35 79.03,2.35 v80.33,3.65 | v43.34,23.65 43.66,23.97 70.07,23.97 v70.87,23.18
CAMERA_D3  (via drill 0.35)
  Top 0.254: v94.52,25.34 94.52,24.43 U2.D3 | v89.53,14.45 v89.53,20.8 | v82.23,12.54 82.55,12.22 82.55,5.08 J7.5 | SV4.4 50.16,38.73 v50.16,16.51 | v59.37,15.88 60.64,14.61 v60.64,12.54
  Bottom 0.254: v94.52,25.34 91.57,22.38 91.12,22.38 v89.53,20.8 | v89.53,14.45 87.63,12.54 v82.23,12.54 80.96,12.54 80.64,12.22 74.3,12.22 74.14,12.38 60.8,12.38 v60.64,12.54 | v50.16,16.51 50.8,15.88 v59.37,15.88
CAMERA_D4  (via drill 0.35)
  Top 0.254: v90.01,40.16 90.2,39.97 90.2,32.46 U2.~D4 | SV4.5 48.26,41.27 v50.96,38.58 50.96,10.48 v51.12,10.32 | v79.31,9.94 79.31,6.39 78.99,5.72 J7.12
  Bottom 0.254: v90.01,40.16 83.98,40.16 82.87,39.05 79.06,39.05 78.9,39.21 57.47,39.21 56.83,38.58 v50.96,38.58 | v79.31,9.94 78.93,10.32 v51.12,10.32
CAMERA_D5  (via drill 0.35)
  Top 0.254: v91.6,30.8 91.6,31.59 U2.~D5 | v73.66,31.59 73.5,31.43 73.66,31.27 73.66,17.02 72.14,15.49 72.14,7.11 73.15,6.1 74.77,6.1 74.99,5.88 J7.20 | SV4.6 51.75,42.23 v51.75,33.81
  Bottom 0.254: v91.6,30.8 90.81,31.59 82.07,31.59 81.76,31.27 73.98,31.27 v73.66,31.59 62.55,31.59 61.44,32.7 53.5,32.7 52.55,33.66 51.91,33.66 v51.75,33.81
CAMERA_D6  (via drill 0.35)
  Top 0.254: v78.9,27.15 80.96,29.21 80.96,31.43 U2.~D6 | v55.09,29.53 53.34,31.27 SV4.7 | v74.42,27.62 74.42,15.24 72.9,13.72 72.9,7.11 73.41,6.6 74.84,6.6 75.49,5.95 J7.19
  Bottom 0.254: v78.9,27.15 78.42,27.62 v74.42,27.62 69.22,27.62 67.31,29.53 v55.09,29.53
CAMERA_D7  (via drill 0.35)
  Top 0.254: v91,34.07 91,32.67 91.12,32.54 U2.D7 | SV4.8 v55.88,35.56 55.88,21.75 v56.99,20.64 | v78.26,13.65 78.26,10.03 78.83,9.46 78.83,6.57 78.42,6.16 78.42,5.08 J7.13 | v83.82,13.49 84.77,14.45 84.77,18.73 85.41,19.37 v85.41,20.32
  Bottom 0.254: v91,34.07 91,33.81 90.68,33.5 82.07,33.5 81.12,34.45 65.25,34.45 64.93,34.13 61.91,34.13 60.48,35.56 v55.88,35.56 | v78.26,13.65 78.42,13.49 v83.82,13.49 | v85.41,20.32 85.09,20.64 v56.99,20.64
CAMERA_DVDD_EN  (via drill 0.35)
  Top 0.254: v80.96,11.59 80.64,11.91 80.64,22.38 81.6,23.34 81.6,30.96 87,30.96 U2.~AD32 | v64.29,11.59 64.14,11.43 64.14,3.81 | SV3.7 20.32,36.99 21.91,35.4 v21.91,19.84 | 64.14,3.81 JP2.3 | 64.14,3.81 JP2.1
  Bottom 0.254: v80.96,11.59 v64.29,11.59 60.64,11.59 60.01,12.22 32.54,12.22 28.42,16.35 25.4,16.35 v21.91,19.84
CAMERA_HSYNC  (via drill 0.35)
  Top 0.254: v83.34,24.13 82.55,23.34 v82.55,19.21 | SV5.6 66.04,20.8 v67.63,19.21 67.94,18.89 67.94,10.51 v68.93,9.53 | v77.56,9.14 77.56,8.89 76.99,8.32 76.99,5.08 J7.16 | 89.21,24.07 U2.D17 89.21,24.82 v89.47,25.08
  Bottom 0.254: v89.47,25.08 88.52,24.13 v83.34,24.13 | v82.55,19.21 82.23,19.53 67.94,19.53 v67.63,19.21 | v77.56,9.14 77.18,9.53 v68.93,9.53
CAMERA_INT  (via drill 0.35)
  Top 0.254: v93.66,30.8 93.66,31.59 U2.D10 | 72.6,40.69 73.66,41.75 SV5.3 | v72.3,40.89 72.34,40.94 72.6,40.69 | v76.04,3.14 76.04,4.92 J7.18 | v72.01,6.19 71.63,6.57 71.63,16 72.9,17.27 72.87,35.72 73.18,36.04 73.18,40.1 72.6,40.69
  Bottom 0.254: v93.66,30.8 94.93,29.53 96.84,29.53 98.42,31.11 98.42,40.96 82.55,40.96 82.23,40.64 72.55,40.64 v72.3,40.89 | v72.01,6.19 71.25,5.43 71.25,3.4 71.75,2.89 75.79,2.89 v76.04,3.14
CAMERA_MCLK  (via drill 0.35)
  Top 0.254: U2.~D18 87.95,23.18 87.95,17.46 86.04,15.56 v86.04,10.95 | v80.74,10.1 80.96,9.87 v80.96,6.99 80.96,5.08 J7.8 | SV5.7 63.5,29.53 58.58,24.61 58.58,3.02 59.85,1.75 76.99,1.75 v76.99,3.65
  Bottom 0.254: v86.04,10.95 85.19,10.1 v80.74,10.1 | v76.99,3.65 79.53,6.19 80.17,6.19 v80.96,6.99
CAMERA_PCLK  (via drill 0.35)
  Top 0.254: v87.95,25.08 87.95,24.45 87.79,24.29 U2.~D19 | v66.83,40.64 68.36,39.12 68.36,32.7 69.31,31.75 69.31,28.04 v68.26,26.99 68.42,26.83 68.42,14.48 v69.18,13.72 | v76.83,13.81 76.52,13.49 76.52,5.08 J7.17
  Bottom 0.254: v87.95,25.08 87,26.04 81.44,26.04 81.28,25.88 69.37,25.88 v68.26,26.99 | v66.83,40.64 66.2,41.27 62.87,41.27 SV5.8 | v76.83,13.81 76.74,13.72 v69.18,13.72
CAMERA_TRIG  (via drill 0.35)
  Top 0.254: v87.95,30.8 87.95,31.43 87.79,31.59 U2.D14 | v71.6,30.8 71.12,31.27 SV5.4 | v81.76,8.26 81.76,6.83 81.44,6.51 81.44,5.08 J7.7 | v75.25,30.48 v75.25,8.57
  Bottom 0.254: v71.6,30.8 75.25,30.8 | 75.25,30.8 v87.95,30.8 | v81.76,8.26 75.56,8.26 v75.25,8.57 | 75.25,30.8 v75.25,30.48
CAMERA_VSYNC  (via drill 0.35)
  Top 0.254: v83.66,28.73 83.66,28.57 86.2,28.57 U2.D15 89.05,28.45 89.45,28.85 90,28.85 90.4,28.45 | v71.6,29.21 70.58,30.23 70.58,34.83 69.09,36.32 69.09,41.91 68.58,42.42 SV5.5 | 90.42,28.45 90.4,28.45 | 90.4,28.45 90.66,28.19 v90.93,28.19 | v95.76,28.19 95.76,28.96 95.25,29.46 92.96,29.46 92.46,28.96 v92.46,28.45 | v99.4,25.11 99.4,1.99 98.81,1.39 93.22,1.38 92.96,1.63 v92.96,2.54 | v82.04,3.56 81.99,3.61 J7.6 | v98.91,26.92 97.54,26.92 v97.28,26.67
  Bottom 0.254: v83.66,28.73 83.19,29.21 v71.6,29.21 | v92.46,28.45 91.19,28.45 v90.93,28.19 | v97.28,26.67 97.28,26.92 96.01,28.19 v95.76,28.19 | v92.96,2.54 90.17,2.54 87.64,5.07 84.31,5.07 82.8,3.56 v82.04,3.56 | v98.91,26.92 99.16,26.67 99.16,25.89 99.57,25.49 99.57,25.15 99.53,25.11 v99.4,25.11
D13  (via drill 0.35)
  Top 0.254: v88.96,29.4 88.46,28.89 87.06,28.89 U2.~AD13 | v77.47,28.42 76.83,27.78 v76.83,24.61 | v10.32,24.92 10.16,25.08 SV3.3
  Bottom 0.254: v88.96,29.4 87.5,27.94 81.44,27.94 80.96,28.42 v77.47,28.42 | v76.83,24.61 76.52,24.92 v10.32,24.92
D16  (via drill 0.35)
  Top 0.254: U2.AD16 88.71,25.46 89.15,25.91 92.71,25.91 94.49,27.69 v94.49,28.7
  Bottom 0.254: SV3.4 12.7,44.96 14.04,46.29 97.72,46.29 99.31,44.7 99.31,29.97 98.3,28.96 94.74,28.96 v94.49,28.7
D23  (via drill 0.35)
  Top 0.254: v89.06,30.32 88.74,30.64 88.74,31.59 U2.~D23 | v93.34,18.73 92.39,17.78 v92.39,14.45
  Bottom 0.254: v89.06,30.32 90.01,29.37 92.71,29.37 97.16,24.92 97.16,21.43 95.25,21.43 94.14,20.32 94.14,19.21 93.82,19.21 v93.34,18.73 | v92.39,14.45 89.69,11.75 82.07,11.75 81.12,10.79 51.59,10.79 50.64,11.75 8.73,11.75 1.43,19.05 1.43,36.83 SV1.1
D24  (via drill 0.35)
  Top 0.254: SV1.2 6.35,34.29 v7.62,33.02 | U2.~D24 89.71,34.5 87.63,36.58 v87.63,36.69 | v66.8,28.7 66.8,35.56 v67.31,36.07 | v80.52,37.34 81.28,36.58 82.3,36.58 v82.3,36.69
  Bottom 0.254: v7.62,33.02 15.24,33.02 20.32,27.94 53.85,27.94 54.61,28.7 v66.8,28.7 | v67.31,36.07 67.36,36.01 70.22,36.01 71.03,36.83 72.09,36.83 72.12,36.85 72.16,36.85 72.92,37.62 80.24,37.62 v80.52,37.34 | v82.3,36.69 82.3,36.52 87.48,36.52 87.63,36.67 v87.63,36.69
D26  (via drill 0.35)
  Top 0.254: v82.87,25.24 82.87,29.53 86.2,29.53 U2.~D26
  Bottom 0.254: v82.87,25.24 82.71,25.4 63.5,25.4 61.59,27.3 58.26,27.3 56.83,25.88 14.92,25.88 13.49,27.3 5.71,27.3 SV1.4
D28  (via drill 0.35)
  Top 0.254: v82.71,40.1 82.71,37.81 82.96,37.56 82.96,32.73 84.33,32.73 | v58.74,42.7 55.88,45.56 8.73,45.56 8.73,29.05 SV1.6 | 87.15,32.54 U2.~D28 86.06,33.59 86.06,34.56 85.68,34.95 85.14,34.95 84.75,34.56 84.75,33.16 84.33,32.73 | 84.33,32.73 84.36,32.73
  Bottom 0.254: v82.71,40.1 78.9,40.1 78.64,39.85 61.59,39.85 v58.74,42.7
D29  (via drill 0.35)
  Top 0.254: v84.61,19.53 84.61,26.35 86.2,26.35 U2.~AD29 | v18.57,23.34 15.24,26.67 SV3.5
  Bottom 0.254: v84.61,19.53 84.14,20 57.31,20 57.15,19.84 35.56,19.84 32.07,23.34 v18.57,23.34
D31  (via drill 0.35)
  Top 0.254: v88.74,22.07 89.69,23.02 89.69,24.13 U2.~AD31 | v69.44,17.3 70.07,17.94 70.07,32.42 v69.31,33.18 | v18.57,34.61 17.78,35.4 SV3.6
  Bottom 0.254: v88.74,22.07 87.47,20.8 86.84,20.8 83.34,17.3 v69.44,17.3 | v69.31,33.18 53.66,33.18 52.23,34.61 v18.57,34.61
D33  (via drill 0.35)
  Top 0.254: v89.72,28.19 89.47,27.94 U2.~AD33/SWO | v80.8,27.62 80.64,27.46 v80.64,24.61 | v42.39,24.13 42.55,24.29 42.55,40.16 v41.43,41.27
  Bottom 0.254: v89.72,28.19 89,27.46 80.96,27.46 v80.8,27.62 | v80.64,24.61 79.85,23.81 71.12,23.81 70.48,24.45 42.7,24.45 v42.39,24.13 | v41.43,41.27 24.77,41.27 SV3.8
D34  (via drill 0.35)
  Top 0.254: v83.82,14.45 83.82,19.68 84.14,20 84.14,27.3 86.2,27.3 U2.AD34 | v49.53,15.4 48.26,16.67 v48.26,39.21
  Bottom 0.254: v83.82,14.45 83.5,14.76 58.26,14.76 57.63,15.4 v49.53,15.4 | v48.26,39.21 26.04,39.21 23.97,41.27 22.38,41.27 21.75,41.91 21.75,45.09 23.5,45.09 SV3.9
D35  (via drill 0.35)
  Top 0.254: v90.65,30.8 90.65,31.59 U2.~AD35 | v60.33,34.77 v62.71,32.38 | SV3.10 v35.72,35.4
  Bottom 0.254: v90.65,30.8 91.44,30 91.76,30 92.39,30.64 92.39,32.07 81.92,32.07 81.6,31.75 74.45,31.75 73.82,32.38 v62.71,32.38 | v60.33,34.77 52.7,34.77 52.07,35.4 v35.72,35.4
D36
  Top 0.254: SV1.7 1.99,21.6 1.14,22.44 1.14,42.75 4.62,46.23 84.26,46.23 84.33,46.29 96.01,46.29 99.87,42.43 99.87,26.64 99.15,25.91 96.27,25.91 95.21,24.85 U2.D36
D37  (via drill 0.35)
  Top 0.254: v96.2,26.96 96.71,27.46 97.73,27.46 98.2,27.94 98.2,38.32 v97.63,38.89 | v65.25,38.26 63.98,36.99 63.98,29.05 v61.44,26.51 | 96.2,23.5 U2.~D37 96.21,24.64 96.72,25.15 v97.81,25.15
  Bottom 0.254: v97.63,38.89 97.31,38.58 78.9,38.58 78.74,38.73 65.72,38.73 v65.25,38.26 | v61.44,26.51 60.33,25.4 10.79,25.4 10.48,25.72 10.16,25.72 5.71,21.27 5.71,19.05 SV1.8 | v96.2,26.96 96.2,26.82 97.79,25.23 97.79,25.15 v97.81,25.15
D38
  Top 0.254: SV6.1 98.42,4.45 98.42,16.35 95.57,16.35 94.61,17.3 94.61,21.43 95.73,22.54 95.73,24.13 U2.D38
D39  (via drill 0.35)
  Top 0.254: v95.57,30.8 95.57,31.59 U2.~D39 | v81.44,32.54 78.26,29.37 78.26,27.46 78.11,27.3 78.11,15.08 80.01,13.18 v80.01,9.21
  Bottom 0.254: v95.57,30.8 93.82,32.54 87.38,32.54 84.33,32.54 v81.44,32.54 | v80.01,9.21 80.17,9.05 92.55,9.05 SV6.2
D40  (via drill 0.35)
  Top 0.254: v95.09,39.37 95.09,32.54 U2.D40 | v85.25,39.37 84.61,40.01 84.61,41.12 84.45,41.27 82.87,41.27 82.23,40.64 79.85,40.64 79.85,44.45 79.22,45.09 69.94,45.09 v69.94,36.67 | v65.25,36.61 65.56,36.29 65.56,17.94 v67.15,16.35
  Bottom 0.254: v85.25,39.37 v95.09,39.37 | v65.25,36.61 65.5,36.86 69.75,36.86 v69.94,36.67 | v67.15,16.35 67.79,15.72 90.01,15.72 90.96,16.67 97.47,16.67 98.42,15.72 98.42,7.62 SV6.3
D41  (via drill 0.35)
  Top 0.254: v88.74,10.95 88.74,20.95 90.17,22.38 90.17,23.34 U2.D41
  Bottom 0.254: v88.74,10.95 89.53,10.16 SV6.4
D42
  Top 0.254: SV6.5 94.14,15.08 94.14,23.34 U2.~D42
D43  (via drill 0.35)
  Top 0.254: v93.57,25.59 93.57,24.38 U2.~D43 | v91.12,15.88 v91.12,21.27
  Bottom 0.254: v93.57,25.59 93.57,26.1 94.14,26.67 95.57,25.24 95.57,21.91 91.76,21.91 v91.12,21.27 | v91.12,15.88 91.76,15.24 SV6.6
D44
  Top 0.254: SV6.7 98.74,20 98.74,24.29 96.84,24.29 U2.~D44
D45  (via drill 0.35)
  Top 0.254: v90.81,25.08 90.81,24.29 U2.~D45 | v96.36,22.23 96.52,22.07 SV6.8
  Bottom 0.254: v96.36,22.23 96.36,25.08 94.12,27.32 93.86,27.58 92.44,27.58 92.05,27.19 92.05,26.77 91.44,26.16 90.93,26.16 90.81,26.04 v90.81,25.08 90.81,25.53
FTDI_VCC  (via drill 0.35)
  Top 0.254: v43.66,7.62 D3.A | v82.87,42.23 82.87,42.07 86.36,42.07 88.9,39.53 J1.4 | v67.79,41.27 67.15,41.91 67.15,44.45 66.52,45.09 62.07,45.09 62.07,37.47 57.94,33.34 57.94,9.68 J4.4 J4.3
  Bottom 0.254: v43.66,7.62 43.81,7.46 53.5,7.46 J4.4 | v82.87,42.23 80.17,42.23 79.22,41.27 73.12,41.27 72.36,42.04 71.6,41.27 v67.79,41.27
GND  (via drill 0.35)
  Top 0.254: v21.43,13.81 21.27,13.97 21.27,14.29 20.64,14.29 U3.P$7 | v23.5,14.92 22.7,14.92 U3.P$1 22.54,15.08 20,17.62 20,17.78 C5.2 19.84,17.78 19.84,20.32 | 14.76,28.89 14.76,25.4 19.29,20.88 | 14.76,28.89 14.76,37.78 14.45,38.1 R28.1 | 19.84,20.32 19.29,20.88 | 19.84,20.32 C6.2 | R1.1 19.37,38.1 19.37,20.95 19.29,20.88 | 8.26,12.22 10.95,12.22 10.95,11.43 C3.1 11.11,11.43 12.22,10.32 12.22,9.53 | 8.26,12.22 5.08,12.22 4.29,11.43 C4.1 | 12.22,9.53 12.22,5.56 10.79,4.13 U4.1 | 12.22,9.53 21.91,9.53 25.88,5.56 S3.1 26.04,5.56 29.84,5.56 S3.2 30,5.4 31.91,5.4 32.38,4.92 35.08,4.92 35.08,6.03 35.88,6.83 45.4,6.83 45.4,7.3 46.91,8.81 | 14.76,28.89 11.11,28.89 11.11,22.38 8.26,19.53 8.26,12.22 | v85.41,34.29 85.41,33.34 86.2,32.54 U2.GND@22 | J1.6 v83.82,34.29 | v97.95,23.21 97.95,23.5 97.31,23.5 U2.GND@59 | v97.41,28.13 97.31,28.13 97.31,32.38 U2.GND@1 97.16,32.54 v97.16,33.66 | U2.GND@38 86.36,23.5 87.15,23.5 U2.GND@39 87.15,23.34 v87.15,20 | 92.23,10.16 92.23,7.78 92.08,7.62 C8.1 91.92,7.62 91.92,1.75 79.85,1.75 78.82,2.78 | 92.23,10.16 92.23,12.54 92.08,12.7 C12.2 91.92,12.7 91.92,12.86 90.88,13.89 | 92.23,10.16 C9.2 | 90.88,13.89 90.33,14.45 v90.33,17.94 v90.33,20 90.33,21.43 90.65,21.75 90.65,22.86 91.12,23.34 U2.GND@47 | 78.82,2.78 77.47,4.13 77.47,4.92 J7.15 | 90.88,13.89 90.17,13.18 90.17,11.43 88.58,9.84 88.58,6.19 84.45,6.19 83.98,5.71 83.98,5.08 J7.2 | 83.82,39.37 J1.6 | 30.16,19.05 30.16,14.76 30.48,14.45 IC1.3 | R3.1 34.61,17.78 33.18,19.21 33.18,25.24 35.88,27.94 C11.1 35.72,27.94 35.72,29.05 | 35.72,29.05 35.72,31.27 33.97,33.02 C17.2 33.81,33.02 33.81,34.29 28.1,34.29 27.46,33.66 27.46,32.38 30.64,29.21 30.64,19.53 30.16,19.05
  Top 0.254: 35.72,29.05 38.58,29.05 39.69,27.94 C10.1 39.37,28.1 39.37,21.59 R13.1 41.12,21.59 46.51,16.19 46.51,9.21 46.91,8.81 | 30.16,19.05 C7.2 | 63.34,14.45 63.34,15.72 63.98,16.35 63.98,16.51 C22.2 64.14,16.51 64.14,20.32 C23.2 | 63.34,14.45 63.34,13.02 63.02,12.7 R11.1 62.87,12.7 v62.23,13.34 | 63.34,14.45 65.72,12.06 65.72,10.64 66.04,10.32 U1.2 | J5.3 J5.5 54.61,12.54 | J5.9 56.36,12.54 54.61,12.54 | J4.1 J4.2 52.55,6.83 52.55,10.48 54.61,12.54 | 46.91,8.81 47.47,8.26 47.47,4.29 JP5.1 45.88,2.54 45.88,1.27 77.31,1.27 78.82,2.78 | J1.6 84.66,38.61 85.34,38.61 85.58,38.37 85.58,37.83 86,37.42 86.69,37.42 v86.71,37.4
  Bottom 0.254: v21.43,13.81 22.54,14.92 v23.5,14.92 | v83.82,34.29 v85.41,34.29 | v90.33,20 v87.15,20 | v90.33,17.94 93.5,17.94 94.46,18.89 98.42,18.89 98.42,20.8 97.95,21.27 v97.95,23.21 97.95,23.27 98.55,23.88 98.55,25.93 98,26.48 98,28.13 v97.41,28.13 | v86.71,37.4 86.96,37.66 91.09,37.66 93.03,35.72 95.09,35.72 v97.16,33.66 | JP3.1 39.85,4.29 43.97,4.29 JP5.1 45.72,2.7 46.83,3.81 J4.1 | J5.9 v62.23,13.34
N$1
  Top 0.254: R11.2 64.14,12.7 65.09,11.75 65.09,10.32 U1.3 65.25,10.16 65.41,10 65.41,8.57 65.72,8.26 65.72,3.81 | 65.72,3.81 JP2.2 | 65.72,3.81 JP2.4
N$2  (via drill 0.35)
  Top 0.254: IC1.5 28.42,13.97 28.42,19.05 | v33.97,20.48 33.97,20.95 34.61,21.59 R9.1 | 28.42,19.05 v29.84,20.48 | 28.42,19.05 C7.1
  Bottom 0.254: v29.84,20.48 v33.97,20.48
N$3  (via drill 0.35)
  Top 0.254: IC1.2 31.43,13.97 v31.43,14.29 | 36.2,13.97 36.2,17.62 36.35,17.78 R3.2 | 36.2,13.97 JP6.1 | 36.2,13.97 JP6.3
  Bottom 0.254: v31.43,14.29 32.38,15.24 35.56,15.24 JP6.3
N$4
  Top 0.254: 4.6,6.35 4.6,10.16 5.87,11.43 C4.2 | 4.6,6.35 9.21,6.35 | 9.21,6.35 U4.2 | 4.6,6.35 U4.4 | JP4.2 15.08,2.38 9.21,2.38 9.21,6.35
N$5
  Top 0.254: J2.3 9.53,19.37 10.48,20.32 R5.1
N$7
  Top 0.254: J2.2 13.34,12.7 17.62,12.7 17.78,12.86 20.48,12.86 U3.P$5
N$14  (via drill 0.35)
  Top 0.254: v85.41,21.91 85.09,22.23 85.09,25.4 86.2,25.4 U2.XI | v40.16,22.54 40.48,22.86 40.48,24.13 Y1.P$2 40.64,24.13 40.64,27.15 41.43,27.94 C10.2
  Bottom 0.254: v85.41,21.91 57.31,21.91 56.83,22.38 40.32,22.38 v40.16,22.54
N$15  (via drill 0.35)
  Top 0.254: U2.XO 87.45,26.38 92.17,26.38 v92.71,26.92 | v38.58,21.75 38.26,22.07 38.26,24.13 Y1.P$1 38.1,24.13 38.1,27.62 37.78,27.94 C11.2
  Bottom 0.254: v38.58,21.75 56.83,21.75 57.47,21.11 85.57,21.11 87.31,22.86 90.49,22.86 v92.71,25.08 v92.71,26.92
PDM_CLK  (via drill 0.35)
  Top 0.254: v87.95,29.84 87.15,29.84 U2.~AD12 | v11.75,36.67 10.95,37.47 v10.95,39.85
  Bottom 0.254: v87.95,29.84 87.79,29.69 72.07,29.69 71.75,30 55.56,30 54.45,31.11 20.8,31.11 15.24,36.67 v11.75,36.67 | SV3.2 v10.95,39.85
PDM_DATA  (via drill 0.35)
  Top 0.254: v90.27,27.3 90.27,26.99 87.15,26.99 U2.~AD11 | v79.85,27.15 79.85,26.89 78.9,25.94 v78.9,23.02 | v9.53,24.13 7.46,24.13 6.35,23.02 1.91,23.02 1.91,40.01 SV3.1
  Bottom 0.254: v90.27,27.3 89.95,26.99 81.12,26.99 80.96,26.83 79.92,26.83 79.85,26.89 v79.85,27.15 | v78.9,23.02 78.26,22.38 58.42,22.38 57.31,23.5 44.13,23.5 43.5,22.86 40.8,22.86 39.53,24.13 v9.53,24.13
SCL  (via drill 0.35)
  Top 0.254: v91.95,34.07 91.95,32.67 92.08,32.54 U2.D8 | 79.33,37.35 78.74,37.94 SV5.1 | 79.33,37.35 v82.17,34.51 | 79.33,37.35 v78.68,36.7 | J7.21 74.45,4.92 74.45,2.95 73.72,2.22 69.53,2.22 69.53,4.92 70.01,5.4 70.61,5.4 71.12,5.91 71.12,16.26 72.39,17.53 v72.39,36.2
  Bottom 0.254: v91.95,34.07 91.95,34.32 91.19,35.08 82.74,35.08 v82.17,34.51 | v72.39,36.2 73.15,36.96 78.42,36.96 v78.68,36.7
SCL2  (via drill 0.35)
  Top 0.254: v23.5,13.02 22.7,13.02 U3.P$4 | v26.99,13.02 27.78,13.02 27.78,13.49 IC1.6 | U2.~D27 86.68,33.97 86.68,35.91 v84.87,37.72 | v13.65,26.19 13.65,20.95 14.29,20.32 R4.1 14.45,20.32 14.45,20.16 v15.24,19.37
  Bottom 0.254: v26.99,13.02 25.24,13.02 | 25.24,13.02 v23.5,13.02 | v84.87,37.72 84.49,38.1 78.74,38.1 78.58,38.26 70.04,38.26 69.25,37.47 9.37,37.47 4.76,32.86 2.54,32.86 1.91,32.23 1.91,26.67 SV1.5 13.18,26.67 v13.65,26.19 | 25.24,13.02 25.24,15.88 18.73,15.88 v15.24,19.37
SDA  (via drill 0.35)
  Top 0.254: v94.61,30.8 94.61,31.59 U2.D9 | SV5.2 v76.2,36.16 76.2,35.91 76.04,35.75 76.04,8.13 75.73,7.82 v75.73,6.64 | v73.15,3.71 v73.16,3.71 73.5,3.71 73.99,4.2 J7.22
  Bottom 0.254: v94.61,30.8 95.41,30 96.68,30 97.95,31.27 97.95,38.1 86.45,38.1 85.28,36.92 83.98,36.92 83.31,37.59 81.96,37.59 81.03,36.67 80.01,36.67 79.25,35.91 76.2,35.91 v76.2,36.16 | v75.73,6.64 73.95,6.64 73.15,5.84 v73.15,3.71
SDA2  (via drill 0.35)
  Top 0.254: 21.51,12.94 20.8,12.22 11.43,12.22 11.43,20.95 11.59,21.11 11.91,21.11 | 21.51,12.94 22.07,13.49 22.54,13.49 U3.P$3 | 11.91,21.11 13.18,21.11 13.18,17.78 R2.1 | v24.45,14.45 27.62,14.45 | 27.62,14.45 27.78,14.45 IC1.4 27.62,14.45 | v21.59,12.86 21.51,12.94 | v81.44,18.73 81.44,22.54 82.07,23.18 82.07,30.32 86.2,30.32 U2.~D25 | 27.62,14.45 v27.62,17.14 | 11.91,21.11 v11.91,28.1
  Bottom 0.254: v24.45,14.45 23.81,13.81 22.54,13.81 v21.59,12.86 | v81.44,18.73 81.28,18.89 68.42,18.89 67.79,18.26 28.73,18.26 v27.62,17.14 | SV1.3 7.46,28.1 v11.91,28.1
TGT_BOOT  (via drill 0.35)
  Top 0.254: v16.99,39.21 16.99,38.89 16.19,38.1 R28.2 | v25.08,39.21 26.19,38.1 C2.2 32.38,38.1 32.38,37.78 35.56,34.61 36.35,34.61 36.35,35.08 36.83,35.56 TP4.P$1 36.83,45.09 44.29,45.09 | v93.98,33.34 93.98,32.7 94.14,32.54 U2.BOOT | v54.45,33.97 54.45,44.45 53.82,45.09 44.29,45.09 | 44.29,45.09 44.29,41.91 44.13,41.75 44.13,22.86 42.86,21.59 R13.2
  Bottom 0.254: v25.08,39.21 v16.99,39.21 | v93.98,33.34 93.66,33.02 81.92,33.02 80.96,33.97 65.41,33.97 65.09,33.66 61.75,33.66 61.44,33.97 v54.45,33.97
TGT_SWCLK  (via drill 0.35)
  Top 0.254: v96.52,30.8 96.52,31.43 96.68,31.59 U2.SWDCK | v64.77,34.92 64.45,34.61 64.45,24.29 v59.37,19.21 | v53.82,19.05 53.34,18.57 J5.4 | TP1.P$1 28.89,29.53 v28.89,20.48
  Bottom 0.254: v96.52,30.8 96.52,33.34 94.93,33.34 93.03,35.24 92.68,35.24 92.36,35.56 82.26,35.56 81.63,34.92 v64.77,34.92 | v59.37,19.21 59.21,19.05 v53.82,19.05 30.32,19.05 v28.89,20.48
TGT_SWDIO  (via drill 0.35)
  Top 0.254: U2.SWDIO 92.71,35.15 91.5,36.35 v91.25,36.35 | 52.55,32.86 52.55,15.08 J5.2 | 52.55,32.86 v52.55,36.35 | TP2.P$1 21.11,34.77 v21.11,33.81 | 52.55,32.86 v52.39,32.86
  Bottom 0.254: v91.25,36.35 90.49,36.35 90.17,36.04 82.11,36.04 81.47,35.4 65.25,35.4 64.29,36.35 v52.55,36.35 | v21.11,33.81 22.07,32.86 v52.39,32.86
TGT_SWO  (via drill 0.35)
  Top 0.254: v55.09,27.78 54.61,27.3 J5.6 | U2.~D22 89.22,32.38 89.22,31.11 91.59,28.74 91.59,27.41 v91.39,27.21 v91.38,27.21
  Bottom 0.254: v91.38,27.21 90.68,26.51 81.28,26.51 81.12,26.35 69.85,26.35 68.42,27.78 v55.09,27.78
UART-RX  (via drill 0.35)
  Top 0.254: v96.04,35.72 96.04,32.7 96.2,32.54 U2.RXI-0 | v92.39,37.31 91.44,38.26 J1.3 91.44,39.69 v89.38,41.75 | v81.09,44.93 82.07,43.94 v82.07,41.43
  Bottom 0.254: v96.04,35.72 94.46,37.31 v92.39,37.31 | SV3.11 33.02,45.72 80.3,45.72 v81.09,44.93 | v82.07,41.43 89.06,41.43 v89.38,41.75
UART-TX  (via drill 0.35)
  Top 0.254: U2.TXO-0 93.19,32.54 93.19,38.58 93.98,39.37 J1.2 93.98,42.55 83.53,42.55 82.68,43.4 82.68,45.72 61.12,45.72 60.33,44.93 v59.05,44.93
  Bottom 0.254: SV3.12 34.92,45.09 58.9,45.09 v59.05,44.93
V_BATT
  Top 0.254: 35.56,3.81 35.56,5.87 45.09,5.87 46.83,7.62 D1.A | 35.56,3.81 JP4.1 | 35.56,3.81 JP3.2
VDD  (via drill 0.35)
  Top 0.254: 90.65,10.16 90.65,7.78 90.81,7.62 C8.2 90.65,7.62 87.95,4.92 87.95,3.17 87,2.22 83.03,2.22 83.03,2.6 | 90.65,10.16 90.65,12.54 90.81,12.7 C12.1 | 90.65,10.16 C9.1 | 83.03,2.6 80.42,2.6 79.53,3.49 79.53,4.92 J7.11 | 83.03,2.6 83.03,4.92 J7.4 83.03,5.08 v83.03,16.51 | U2.VDD@36 87,25.08 86.36,24.45 U2.VDD@37 86.2,24.29 85.57,24.29 85.57,22.7 86.2,22.07 v86.2,19.21 | v63.34,17.46 63.34,16.83 63.02,16.51 C22.1 | v64.93,16.03 66.83,14.13 66.83,10.32 U1.1 66.99,10.16 68.1,9.05 v68.1,6.19 | 18.26,17.78 18.26,20.32 C6.1 R4.2 16.03,20.32 16.03,18.89 14.92,17.78 R2.2 14.76,17.78 14.76,16.99 12.38,16.99 12.22,17.14 12.22,20.32 R5.2 | U3.P$6 20.48,13.65 20,13.65 20,14.61 20.48,15.08 U3.P$8 | U3.P$8 20.64,14.92 21.27,14.92 21.75,14.45 22.54,14.45 U3.P$2 22.7,14.29 23.18,14.29 24.29,13.18 24.29,11.43 28.42,11.43 28.65,11.67 | 28.65,11.67 30.48,13.49 IC1.1 30.64,13.49 31.59,13.49 32.23,14.13 32.23,30.96 30.16,33.02 R27.2 | 18.26,17.78 20.32,15.72 20.32,15.08 U3.P$8 | 18.26,17.78 C5.1 | 34.92,13.97 34.92,14.29 35.56,14.92 35.56,20.8 36.35,21.59 R9.2 | J4.6 J4.5 55.72,2.38 51.28,2.38 51.28,3.02 50.96,3.33 50.96,9.21 52.07,10.32 J5.1 | JP1.4 JP1.2 | JP1.4 JP6.4 34.92,13.97 | 34.92,13.97 JP6.2 | 28.65,11.67 31.91,8.41 31.91,6.03 32.54,5.4 34.29,5.4 JP1.4
  Bottom 0.254: 63.74,17.07 64.77,16.03 v64.93,16.03 | 63.74,17.07 v63.34,17.46 | v86.2,19.21 83.5,16.51 v83.03,16.51 67.94,16.51 67.31,17.14 63.82,17.14 63.74,17.07 | J5.1 51.44,12.7 35.56,12.7 JP6.4 | v68.1,6.19 67.15,5.24 58.26,5.24 J4.6
VIN1
  Top 0.254: 37.39,8.33 36.83,8.89 JP1.3 JP1.1 | 37.39,8.33 38.1,7.62 D3.C | D1.C 44.45,7.62 44.45,7.78 43.81,8.41 37.47,8.41 37.39,8.33